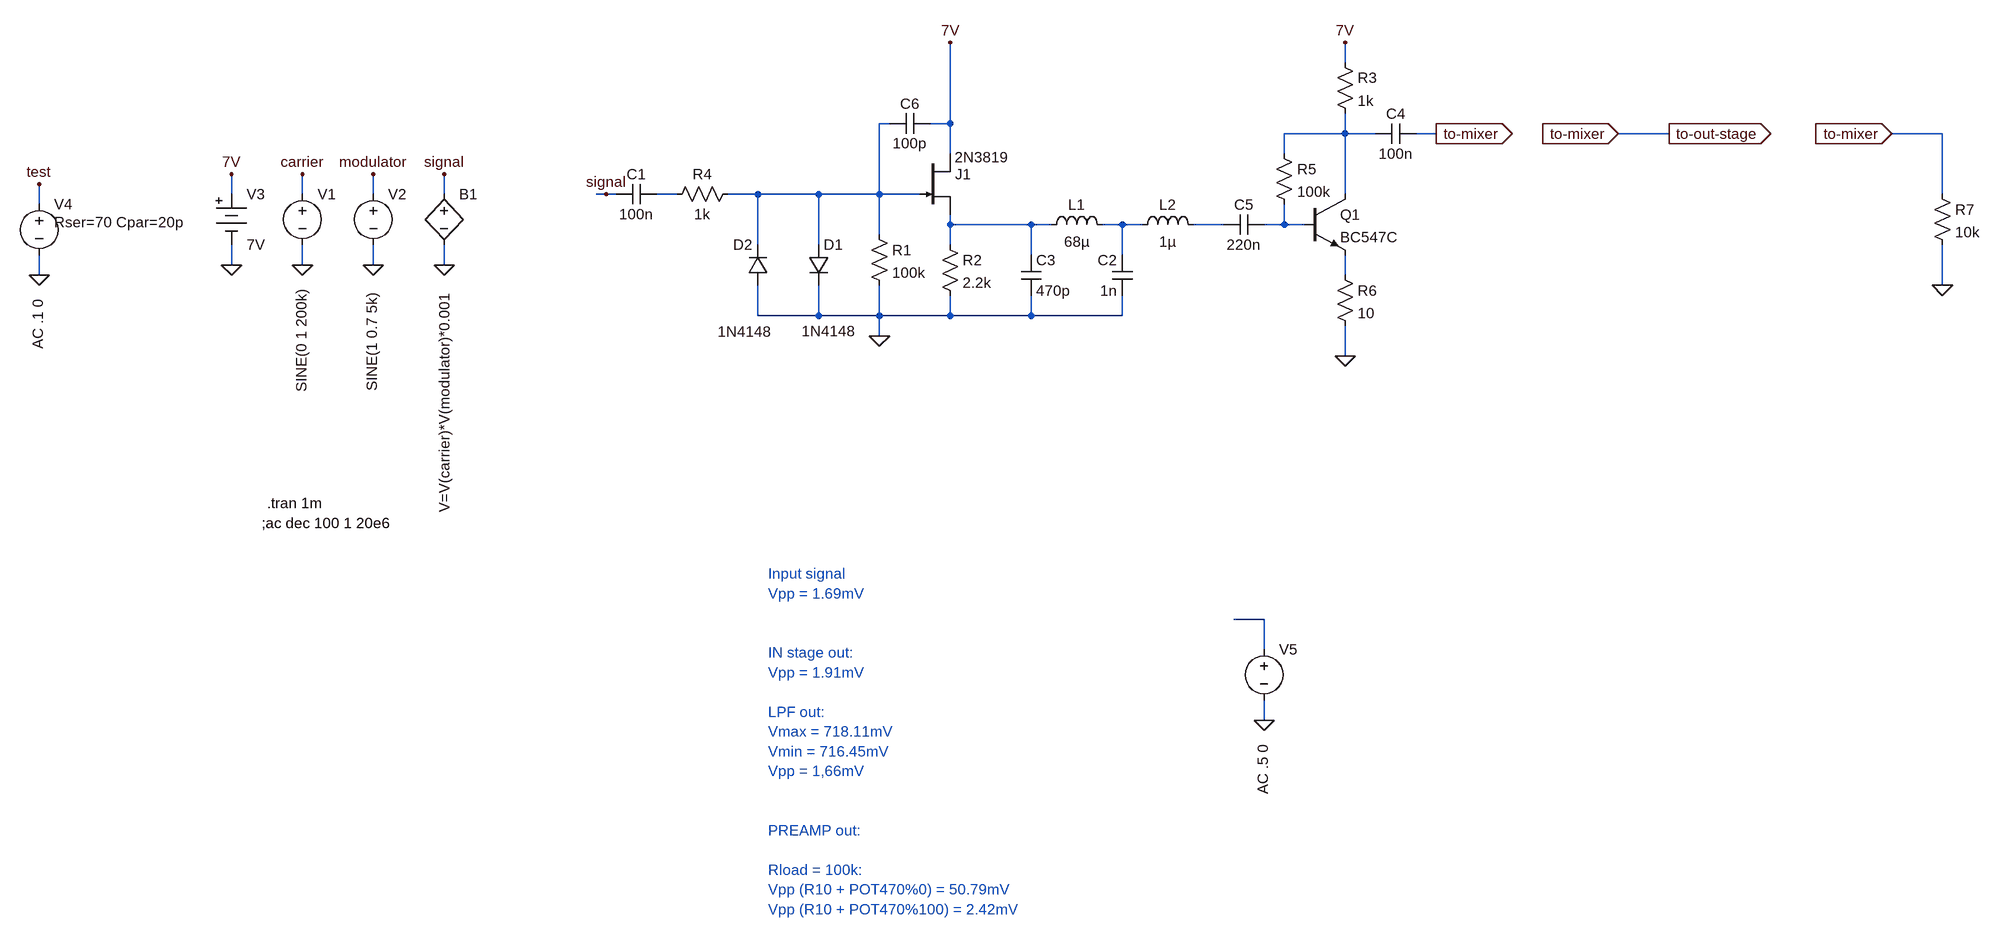
[diagram p0: schematic vlf-converter.asc]
vlf-converter.asc, the LTspice schematic file:
Version 4
SHEET 1 2352 1260
WIRE 1216 16 1216 -16
WIRE 496 112 480 112
WIRE 592 112 592 -16
WIRE 592 112 560 112
WIRE 1216 128 1216 96
WIRE 1216 128 1120 128
WIRE 1264 128 1216 128
WIRE 1360 128 1328 128
WIRE 1728 128 1648 128
WIRE 2160 128 2080 128
WIRE 592 160 592 112
WIRE 1120 160 1120 128
WIRE -544 224 -544 192
WIRE -432 224 -432 192
WIRE -320 224 -320 192
WIRE -208 224 -208 192
WIRE 48 224 32 224
WIRE 64 224 48 224
WIRE 160 224 128 224
WIRE 288 224 240 224
WIRE 384 224 288 224
WIRE 480 224 480 112
WIRE 480 224 384 224
WIRE 544 224 480 224
WIRE 1216 224 1216 128
WIRE 2160 224 2160 128
WIRE -848 240 -848 208
WIRE 592 272 592 256
WIRE 720 272 592 272
WIRE 752 272 720 272
WIRE 864 272 832 272
WIRE 896 272 864 272
WIRE 1024 272 976 272
WIRE 1120 272 1120 240
WIRE 1120 272 1088 272
WIRE 1152 272 1120 272
WIRE 480 288 480 224
WIRE 288 304 288 224
WIRE 384 304 384 224
WIRE 592 304 592 272
WIRE 720 320 720 272
WIRE 864 320 864 272
WIRE -544 336 -544 304
WIRE -432 336 -432 304
WIRE -320 336 -320 304
WIRE -208 336 -208 304
WIRE -848 352 -848 320
WIRE 1216 352 1216 320
WIRE 2160 368 2160 304
WIRE 288 416 288 368
WIRE 384 416 384 368
WIRE 384 416 288 416
WIRE 480 416 480 368
WIRE 480 416 384 416
WIRE 592 416 592 384
WIRE 592 416 480 416
WIRE 720 416 720 384
WIRE 720 416 592 416
WIRE 864 416 864 384
WIRE 864 416 720 416
WIRE 480 448 480 416
WIRE 1216 480 1216 432
WIRE 1088 896 1040 896
WIRE 1088 944 1088 896
WIRE 1088 1056 1088 1024
FLAG 480 448 0
FLAG 592 -16 7V
FLAG -432 336 0
FLAG -320 336 0
FLAG -208 336 0
FLAG -432 192 carrier
FLAG -320 192 modulator
FLAG -208 192 signal
FLAG -544 336 0
FLAG -544 192 7V
FLAG -848 352 0
FLAG -848 208 test
FLAG 1216 480 0
FLAG 1216 -16 7V
FLAG 1088 1056 0
FLAG 48 224 signal
FLAG 1360 128 to-mixer
IOPIN 1360 128 Out
FLAG 1648 128 to-mixer
IOPIN 1648 128 In
FLAG 1728 128 to-out-stage
IOPIN 1728 128 Out
FLAG 2080 128 to-mixer
IOPIN 2080 128 In
FLAG 2160 368 0
SYMBOL njf 544 160 R0
WINDOW 3 55 5 Left 2
SYMATTR Value 2N3819
SYMATTR InstName J1
SYMBOL cap 128 208 R90
WINDOW 0 0 32 VBottom 2
WINDOW 3 32 32 VTop 2
SYMATTR InstName C1
SYMATTR Value 100n
SYMBOL voltage -432 208 R0
WINDOW 3 -1 164 VRight 2
WINDOW 123 0 0 Left 0
WINDOW 39 0 0 Left 0
SYMATTR Value SINE(0 1 200k)
SYMATTR InstName V1
SYMBOL voltage -320 208 R0
WINDOW 3 -2 169 VRight 2
WINDOW 123 0 0 Left 0
WINDOW 39 0 0 Left 0
SYMATTR Value SINE(1 0.7 5k)
SYMATTR InstName V2
SYMBOL bv -208 208 R0
WINDOW 3 1 169 VRight 2
SYMATTR Value V=V(carrier)*V(modulator)*0.001
SYMATTR InstName B1
SYMBOL Misc\\battery -544 208 R0
SYMATTR InstName V3
SYMATTR Value 7V
SYMBOL ind 736 288 R270
WINDOW 0 32 56 VTop 2
WINDOW 3 5 56 VBottom 2
SYMATTR InstName L1
SYMATTR Value 68µ
SYMATTR SpiceLine Rser=2m
SYMBOL cap 880 384 R180
WINDOW 0 24 56 Left 2
WINDOW 3 24 8 Left 2
SYMATTR InstName C2
SYMATTR Value 1n
SYMBOL ind 880 288 R270
WINDOW 0 32 56 VTop 2
WINDOW 3 5 56 VBottom 2
SYMATTR InstName L2
SYMATTR Value 1µ
SYMATTR SpiceLine Rser=1m
SYMBOL voltage -848 224 R0
WINDOW 3 -1 164 VRight 2
WINDOW 123 -2 165 VRight 2
WINDOW 39 24 44 Left 2
SYMATTR Value ""
SYMATTR Value2 AC .1 0
SYMATTR SpiceLine Rser=70 Cpar=20p
SYMATTR InstName V4
SYMBOL cap 704 320 R0
SYMATTR InstName C3
SYMATTR Value 470p
SYMBOL diode 368 304 R0
WINDOW 3 -11 136 Left 2
SYMATTR Value 1N4148
SYMATTR InstName D1
SYMBOL diode 304 368 R180
WINDOW 0 24 64 Left 2
WINDOW 3 -5 -73 Left 2
SYMATTR InstName D2
SYMATTR Value 1N4148
SYMBOL res 256 208 R90
WINDOW 0 0 56 VBottom 2
WINDOW 3 32 56 VTop 2
SYMATTR InstName R4
SYMATTR Value 1k
SYMBOL npn 1152 224 R0
SYMATTR InstName Q1
SYMATTR Value BC547C
SYMBOL res 1200 0 R0
SYMATTR InstName R3
SYMATTR Value 1k
SYMBOL res 1104 144 R0
SYMATTR InstName R5
SYMATTR Value 100k
SYMBOL res 1200 336 R0
SYMATTR InstName R6
SYMATTR Value 10
SYMBOL cap 1264 144 R270
WINDOW 0 32 32 VTop 2
WINDOW 3 0 32 VBottom 2
SYMATTR InstName C4
SYMATTR Value 100n
SYMBOL voltage 1088 928 R0
WINDOW 3 -1 164 VRight 2
WINDOW 123 -2 165 VRight 2
WINDOW 39 0 0 Left 0
SYMATTR Value ""
SYMATTR Value2 AC .5 0
SYMATTR InstName V5
SYMBOL res 576 288 R0
SYMATTR InstName R2
SYMATTR Value 2.2k
SYMBOL res 464 272 R0
SYMATTR InstName R1
SYMATTR Value 100k
SYMBOL cap 1088 256 R90
WINDOW 0 0 32 VBottom 2
WINDOW 3 32 32 VTop 2
SYMATTR InstName C5
SYMATTR Value 220n
SYMBOL cap 560 96 R90
WINDOW 0 0 32 VBottom 2
WINDOW 3 32 32 VTop 2
SYMATTR InstName C6
SYMATTR Value 100p
SYMBOL res 2144 208 R0
SYMATTR InstName R7
SYMATTR Value 10k
TEXT -488 712 Left 2 !.tran 1m
TEXT -496 744 Left 2 !;ac dec 100 1 20e6
TEXT 304 824 Left 2 ;Input signal\nVpp = 1.69mV\n \n\nIN stage out:\nVpp = 1.91mV\n \nLPF out:\nVmax = 718.11mV\nVmin = 716.45mV\nVpp = 1,66mV\n \n\nPREAMP out:\n \nRload = 100k:\nVpp (R10 + POT470%0) = 50.79mV\nVpp (R10 + POT470%100) = 2.42mV

The netlist it stands for:
* vlf-converter.asc
J1 7V N001 N004 2N3819
C1 N003 signal 100n
V1 carrier 0 SINE(0 1 200k)
V2 modulator 0 SINE(1 0.7 5k)
B1 signal 0 V=V(carrier)*V(modulator)*0.001
V3 7V 0 7V
L1 N004 N005 68µ Rser=2m
C2 0 N005 1n
L2 N005 N006 1µ Rser=1m
V4 test 0 AC .1 0 Rser=70 Cpar=20p
C3 N004 0 470p
D1 N001 0 1N4148
D2 0 N001 1N4148
R4 N001 N003 1k
Q1 N002 N007 N008 0 BC547C
R3 7V N002 1k
R5 N002 N007 100k
R6 N008 0 10
C4 N002 to-out-stage 100n
V5 N009 0 AC .5 0
R2 N004 0 2.2k
R1 N001 0 100k
C5 N007 N006 220n
C6 7V N001 100p
R7 to-out-stage 0 10k
.model D D
.lib standard.dio
.model NPN NPN
.model PNP PNP
.lib standard.bjt
.model NJF NJF
.model PJF PJF
.lib standard.jft
.tran 1m
;ac dec 100 1 20e6
* Input signal
* Vpp = 1.69mV
* IN stage out:
* Vpp = 1.91mV
* LPF out:
* Vmax = 718.11mV
* Vmin = 716.45mV
* Vpp = 1,66mV
* PREAMP out:
* Rload = 100k:
* Vpp (R10 + POT470%0) = 50.79mV
* Vpp (R10 + POT470%100) = 2.42mV
.backanno
.end